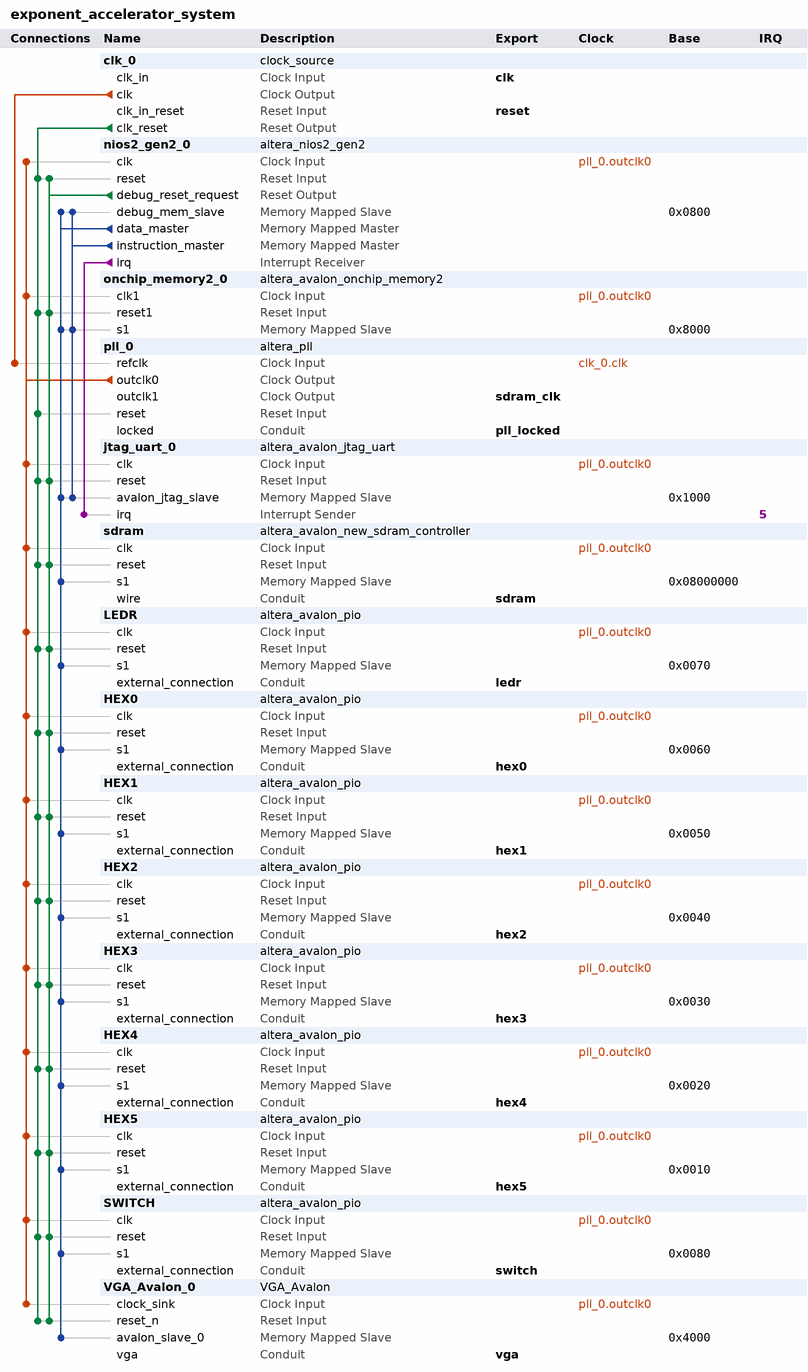
[diagram p0: system contents]
# Platform Designer (Qsys) system exponent_accelerator_system, Cyclone V 5CSEMA5F31C6
# Parameters at their usual value, and those the tool derives, are not listed.
package require -exact qsys 19.1
create_system exponent_accelerator_system
set_project_property DEVICE_FAMILY {Cyclone V}
set_project_property DEVICE 5CSEMA5F31C6

add_instance clk_0 clock_source 19.1
set_instance_parameter_value clk_0 clockFrequency 50000000

add_instance nios2_gen2_0 altera_nios2_gen2 19.1
set_instance_parameter_value nios2_gen2_0 dcache_size 2048
set_instance_parameter_value nios2_gen2_0 exceptionSlave onchip_memory2_0.s1
set_instance_parameter_value nios2_gen2_0 icache_size 4096
set_instance_parameter_value nios2_gen2_0 impl Tiny
set_instance_parameter_value nios2_gen2_0 resetSlave onchip_memory2_0.s1

add_instance onchip_memory2_0 altera_avalon_onchip_memory2 19.1
set_instance_parameter_value onchip_memory2_0 dataWidth 32
set_instance_parameter_value onchip_memory2_0 dualPort false
set_instance_parameter_value onchip_memory2_0 initMemContent true
set_instance_parameter_value onchip_memory2_0 initializationFileName onchip_mem.hex
set_instance_parameter_value onchip_memory2_0 memorySize 32768

add_instance pll_0 altera_pll 19.1
set_instance_parameter_value pll_0 gui_device_speed_grade 1
set_instance_parameter_value pll_0 gui_number_of_clocks 2
set_instance_parameter_value pll_0 gui_operation_mode direct
set_instance_parameter_value pll_0 gui_output_clock_frequency0 50.0
set_instance_parameter_value pll_0 gui_output_clock_frequency1 50.0
set_instance_parameter_value pll_0 gui_phase_shift1 -3000
set_instance_parameter_value pll_0 gui_pll_mode {Integer-N PLL}
set_instance_parameter_value pll_0 gui_reference_clock_frequency 50.0
set_instance_parameter_value pll_0 gui_use_locked true

add_instance jtag_uart_0 altera_avalon_jtag_uart 19.1
set_instance_parameter_value jtag_uart_0 simInteractiveOptions NO_INTERACTIVE_WINDOWS

add_instance sdram altera_avalon_new_sdram_controller 19.1
set_instance_parameter_value sdram TAC 5.4
set_instance_parameter_value sdram TRCD 15.0
set_instance_parameter_value sdram TRP 15.0
set_instance_parameter_value sdram casLatency 3
set_instance_parameter_value sdram columnWidth 10
set_instance_parameter_value sdram dataWidth 16
set_instance_parameter_value sdram generateSimulationModel false
set_instance_parameter_value sdram model single_Micron_MT48LC4M32B2_7_chip
set_instance_parameter_value sdram numberOfBanks 4
set_instance_parameter_value sdram numberOfChipSelects 1
set_instance_parameter_value sdram powerUpDelay 100.0
set_instance_parameter_value sdram refreshPeriod 7.8125
set_instance_parameter_value sdram rowWidth 13

add_instance LEDR altera_avalon_pio 19.1
set_instance_parameter_value LEDR direction Output
set_instance_parameter_value LEDR width 8

add_instance HEX0 altera_avalon_pio 19.1
set_instance_parameter_value HEX0 direction Output
set_instance_parameter_value HEX0 width 7

add_instance HEX1 altera_avalon_pio 19.1
set_instance_parameter_value HEX1 direction Output
set_instance_parameter_value HEX1 width 7

add_instance HEX2 altera_avalon_pio 19.1
set_instance_parameter_value HEX2 direction Output
set_instance_parameter_value HEX2 width 7

add_instance HEX3 altera_avalon_pio 19.1
set_instance_parameter_value HEX3 direction Output
set_instance_parameter_value HEX3 width 7

add_instance HEX4 altera_avalon_pio 19.1
set_instance_parameter_value HEX4 direction Output
set_instance_parameter_value HEX4 width 7

add_instance HEX5 altera_avalon_pio 19.1
set_instance_parameter_value HEX5 direction Output
set_instance_parameter_value HEX5 width 7

add_instance SWITCH altera_avalon_pio 19.1
set_instance_parameter_value SWITCH direction Input
set_instance_parameter_value SWITCH width 8

add_instance VGA_Avalon_0 VGA_Avalon 1.0

# connections
add_connection clk_0.clk pll_0.refclk clock
add_connection pll_0.outclk0 HEX0.clk clock
add_connection pll_0.outclk0 HEX1.clk clock
add_connection pll_0.outclk0 HEX2.clk clock
add_connection pll_0.outclk0 HEX3.clk clock
add_connection pll_0.outclk0 HEX4.clk clock
add_connection pll_0.outclk0 HEX5.clk clock
add_connection pll_0.outclk0 jtag_uart_0.clk clock
add_connection pll_0.outclk0 LEDR.clk clock
add_connection pll_0.outclk0 nios2_gen2_0.clk clock
add_connection pll_0.outclk0 onchip_memory2_0.clk1 clock
add_connection pll_0.outclk0 sdram.clk clock
add_connection pll_0.outclk0 SWITCH.clk clock
add_connection pll_0.outclk0 VGA_Avalon_0.clock_sink clock
add_connection clk_0.clk_reset HEX0.reset reset
add_connection clk_0.clk_reset HEX1.reset reset
add_connection clk_0.clk_reset HEX2.reset reset
add_connection clk_0.clk_reset HEX3.reset reset
add_connection clk_0.clk_reset HEX4.reset reset
add_connection clk_0.clk_reset HEX5.reset reset
add_connection clk_0.clk_reset jtag_uart_0.reset reset
add_connection clk_0.clk_reset LEDR.reset reset
add_connection clk_0.clk_reset nios2_gen2_0.reset reset
add_connection clk_0.clk_reset onchip_memory2_0.reset1 reset
add_connection clk_0.clk_reset pll_0.reset reset
add_connection clk_0.clk_reset sdram.reset reset
add_connection clk_0.clk_reset SWITCH.reset reset
add_connection clk_0.clk_reset VGA_Avalon_0.reset_n reset
add_connection nios2_gen2_0.debug_reset_request HEX0.reset reset
add_connection nios2_gen2_0.debug_reset_request HEX1.reset reset
add_connection nios2_gen2_0.debug_reset_request HEX2.reset reset
add_connection nios2_gen2_0.debug_reset_request HEX3.reset reset
add_connection nios2_gen2_0.debug_reset_request HEX4.reset reset
add_connection nios2_gen2_0.debug_reset_request HEX5.reset reset
add_connection nios2_gen2_0.debug_reset_request jtag_uart_0.reset reset
add_connection nios2_gen2_0.debug_reset_request LEDR.reset reset
add_connection nios2_gen2_0.debug_reset_request nios2_gen2_0.reset reset
add_connection nios2_gen2_0.debug_reset_request onchip_memory2_0.reset1 reset
add_connection nios2_gen2_0.debug_reset_request sdram.reset reset
add_connection nios2_gen2_0.debug_reset_request SWITCH.reset reset
add_connection nios2_gen2_0.debug_reset_request VGA_Avalon_0.reset_n reset
add_connection nios2_gen2_0.data_master HEX0.s1 avalon
set_connection_parameter_value nios2_gen2_0.data_master/HEX0.s1 baseAddress 0x0060
add_connection nios2_gen2_0.data_master HEX1.s1 avalon
set_connection_parameter_value nios2_gen2_0.data_master/HEX1.s1 baseAddress 0x0050
add_connection nios2_gen2_0.data_master HEX2.s1 avalon
set_connection_parameter_value nios2_gen2_0.data_master/HEX2.s1 baseAddress 0x0040
add_connection nios2_gen2_0.data_master HEX3.s1 avalon
set_connection_parameter_value nios2_gen2_0.data_master/HEX3.s1 baseAddress 0x0030
add_connection nios2_gen2_0.data_master HEX4.s1 avalon
set_connection_parameter_value nios2_gen2_0.data_master/HEX4.s1 baseAddress 0x0020
add_connection nios2_gen2_0.data_master HEX5.s1 avalon
set_connection_parameter_value nios2_gen2_0.data_master/HEX5.s1 baseAddress 0x0010
add_connection nios2_gen2_0.data_master jtag_uart_0.avalon_jtag_slave avalon
set_connection_parameter_value nios2_gen2_0.data_master/jtag_uart_0.avalon_jtag_slave baseAddress 0x1000
add_connection nios2_gen2_0.data_master LEDR.s1 avalon
set_connection_parameter_value nios2_gen2_0.data_master/LEDR.s1 baseAddress 0x0070
add_connection nios2_gen2_0.data_master nios2_gen2_0.debug_mem_slave avalon
set_connection_parameter_value nios2_gen2_0.data_master/nios2_gen2_0.debug_mem_slave baseAddress 0x0800
add_connection nios2_gen2_0.data_master onchip_memory2_0.s1 avalon
set_connection_parameter_value nios2_gen2_0.data_master/onchip_memory2_0.s1 baseAddress 0x8000
add_connection nios2_gen2_0.data_master sdram.s1 avalon
set_connection_parameter_value nios2_gen2_0.data_master/sdram.s1 baseAddress 0x08000000
add_connection nios2_gen2_0.data_master SWITCH.s1 avalon
set_connection_parameter_value nios2_gen2_0.data_master/SWITCH.s1 baseAddress 0x0080
add_connection nios2_gen2_0.data_master VGA_Avalon_0.avalon_slave_0 avalon
set_connection_parameter_value nios2_gen2_0.data_master/VGA_Avalon_0.avalon_slave_0 baseAddress 0x4000
add_connection nios2_gen2_0.instruction_master jtag_uart_0.avalon_jtag_slave avalon
set_connection_parameter_value nios2_gen2_0.instruction_master/jtag_uart_0.avalon_jtag_slave baseAddress 0x1000
add_connection nios2_gen2_0.instruction_master nios2_gen2_0.debug_mem_slave avalon
set_connection_parameter_value nios2_gen2_0.instruction_master/nios2_gen2_0.debug_mem_slave baseAddress 0x0800
add_connection nios2_gen2_0.instruction_master onchip_memory2_0.s1 avalon
set_connection_parameter_value nios2_gen2_0.instruction_master/onchip_memory2_0.s1 baseAddress 0x8000
add_connection nios2_gen2_0.irq jtag_uart_0.irq interrupt
set_connection_parameter_value nios2_gen2_0.irq/jtag_uart_0.irq irqNumber 5

# exported interfaces
add_interface clk clock sink
set_interface_property clk EXPORT_OF clk_0.clk_in
add_interface hex0 conduit end
set_interface_property hex0 EXPORT_OF HEX0.external_connection
add_interface hex1 conduit end
set_interface_property hex1 EXPORT_OF HEX1.external_connection
add_interface hex2 conduit end
set_interface_property hex2 EXPORT_OF HEX2.external_connection
add_interface hex3 conduit end
set_interface_property hex3 EXPORT_OF HEX3.external_connection
add_interface hex4 conduit end
set_interface_property hex4 EXPORT_OF HEX4.external_connection
add_interface hex5 conduit end
set_interface_property hex5 EXPORT_OF HEX5.external_connection
add_interface ledr conduit end
set_interface_property ledr EXPORT_OF LEDR.external_connection
add_interface pll_locked conduit end
set_interface_property pll_locked EXPORT_OF pll_0.locked
add_interface reset reset sink
set_interface_property reset EXPORT_OF clk_0.clk_in_reset
add_interface sdram conduit end
set_interface_property sdram EXPORT_OF sdram.wire
add_interface sdram_clk clock source
set_interface_property sdram_clk EXPORT_OF pll_0.outclk1
add_interface switch conduit end
set_interface_property switch EXPORT_OF SWITCH.external_connection
add_interface vga conduit end
set_interface_property vga EXPORT_OF VGA_Avalon_0.vga

set_interconnect_requirement {$system} qsys_mm.clockCrossingAdapter HANDSHAKE
set_interconnect_requirement {$system} qsys_mm.enableEccProtection FALSE
set_interconnect_requirement {$system} qsys_mm.insertDefaultSlave FALSE
set_interconnect_requirement {$system} qsys_mm.maxAdditionalLatency 1

save_system exponent_accelerator_system.qsys
